# Altium schematic sheet Power.SchDoc
size A4
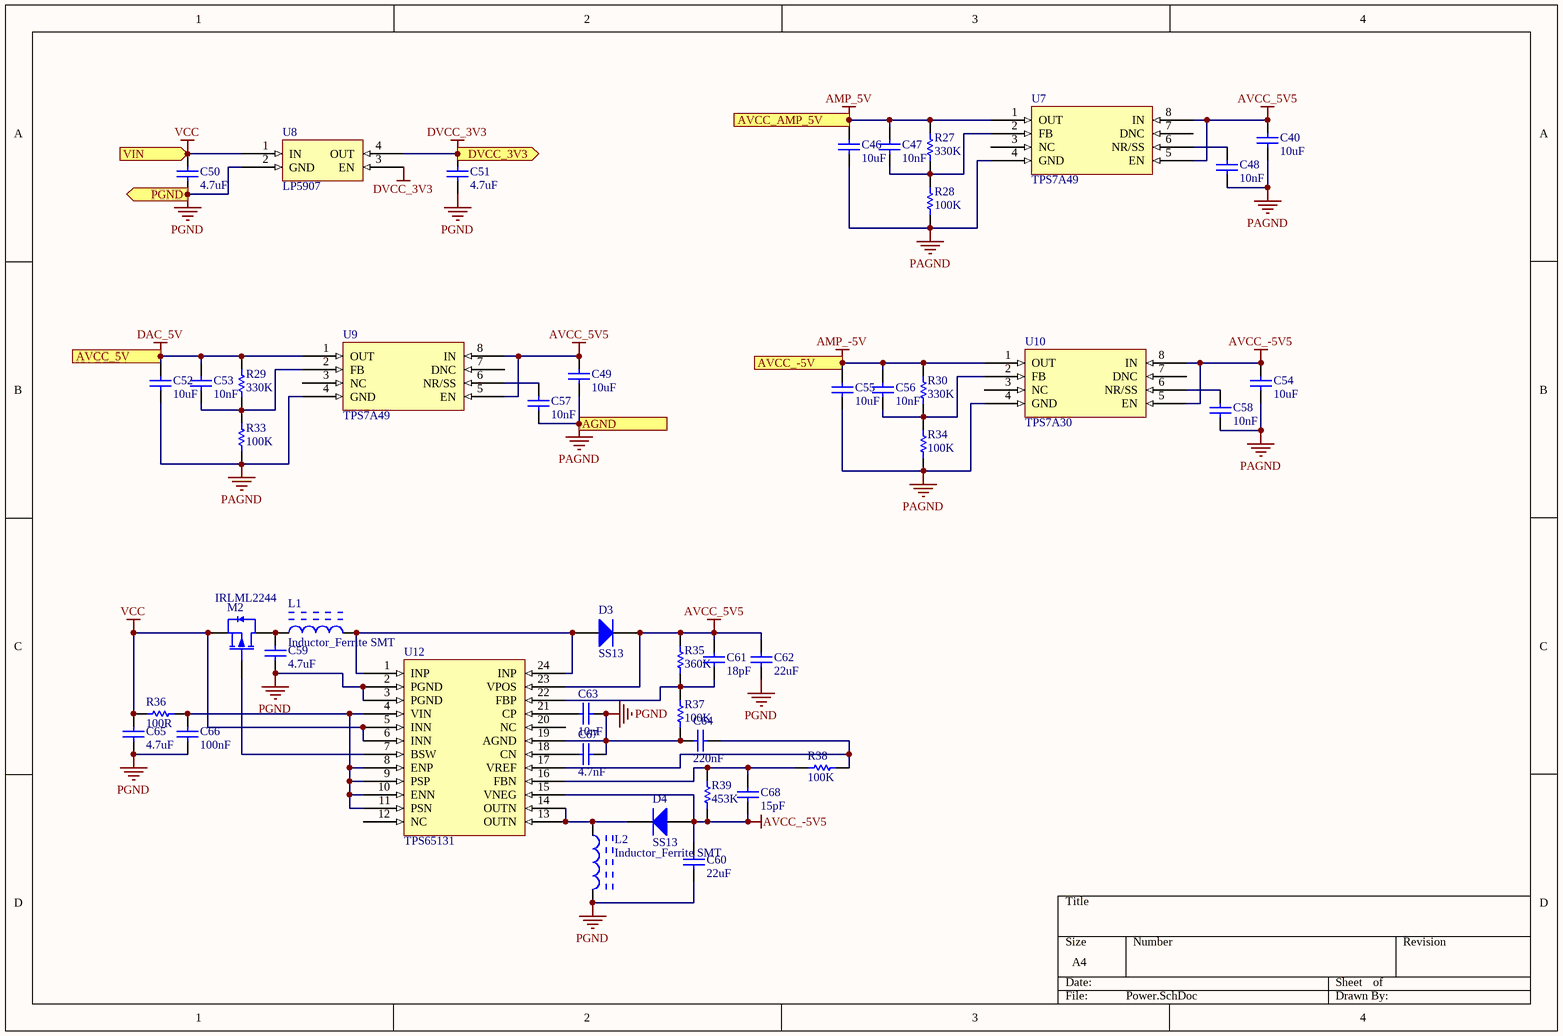
[diagram p0: Power.SchDoc]

## Parts
C40  10uF  [SMC_0805]
C46  10uF  [SMC_0805]
C47  10nF  [SMC_0805]
C48  10nF  [SMC_0805]
C49  10uF  [SMC_0805]
C50  4.7uF  [SMC_0805]
C51  4.7uF  [SMC_0805]
C52  10uF  [SMC_0805]
C53  10nF  [SMC_0805]
C54  10uF  [SMC_0805]
C55  10uF  [SMC_0805]
C56  10nF  [SMC_0805]
C57  10nF  [SMC_0805]
C58  10nF  [SMC_0805]
C59  4.7uF  [SMC_0805]
C60  22uF  [SMC_0805]
C61  18pF  [SMC_0805]
C62  22uF  [SMC_0805]
C63  10nF  [SMC_0805]
C64  220nF  [SMC_0805]
C65  4.7uF  [SMC_0805]
C66  100nF  [SMC_0805]
C67  4.7nF  [SMC_0805]
C68  15pF  [SMC_0805]
D3  SS13  [DO214-AC]
D4  SS13  [DO214-AC]
L1  Inductor_Ferrite SMT  [SML_4x4]
L2  Inductor_Ferrite SMT  [SML_4x4]
M2  IRLML2244  [SOT95P237X112-3N]
R27  330K  [SMR_0402]
R28  100K  [SMR_0402]
R29  330K  [SMR_0402]
R30  330K  [SMR_0402]
R33  100K  [SMR_0402]
R34  100K  [SMR_0402]
R35  360K  [SMR_0402]
R36  100R  [SMR_0805]
R37  100K  [SMR_0402]
R38  100K  [SMR_0402]
R39  453K  [SMR_0402]
U7  TPS7A49  [TSOP65P490X110_HS-9N]
U8  LP5907  [SOT95P280X110-5N - duplicate1]
U9  TPS7A49  [TSOP65P490X110_HS-9N]
U10  TPS7A30  [TSOP65P490X110_HS-9N]
U12  TPS65131  [QFN50P400X400X100_HS-25N]

## Ports
AGND (out), AVCC_5V (out), AVCC_-5V (out), AVCC_AMP_5V (out), DVCC_3V3 (out), PGND (out), VIN (in)

## Nets
AMP_5V: C46.1 C47.2 R27.2 U7.1(OUT) ; port AVCC_AMP_5V
AMP_-5V: C55.1 C56.2 R30.2 U10.1(OUT) ; port AVCC_-5V
AVCC_5V5: C40.1 C49.1 C61.2 C62.2 D3.K R35.2 U7.5(EN) U7.8(IN) U9.5(EN) U9.8(IN) U12.23(VPOS)
AVCC_-5V5: C54.1 C60.2 C68.1 D4.A R39.1 U10.5(EN) U10.8(IN) U12.15(VNEG)
DAC_5V: C52.1 C53.2 R29.2 U9.1(OUT) ; port AVCC_5V
DVCC_3V3: C51.2 U8.3(EN) U8.4(OUT) ; port DVCC_3V3
PAGND: C40.2 C46.2 C48.1 C49.2 C52.2 C54.2 C55.2 C57.1 C58.1 R28.1 R33.1 R34.1 U7.4(GND) U9.4(GND) U10.4(GND) ; port AGND
PGND: C50.1 C51.1 C59.1 C60.1 C62.1 C63.2 C64.1 C65.1 C66.1 C67.2 L2.2 R37.1 U8.2(GND) U12.2(PGND) U12.3(PGND) U12.19(AGND) ; port PGND
VCC: C50.2 C65.2 M2.S R36.1 U8.1(IN) U12.5(INN) U12.6(INN) ; port VIN
NetC47_1: C47.1 R27.1 R28.2 U7.2(FB)
NetC48_2: C48.2 U7.6(NR/SS)
NetC53_1: C53.1 R29.1 R33.2 U9.2(FB)
NetC56_1: C56.1 R30.1 R34.2 U10.2(FB)
NetC57_2: C57.2 U9.6(NR/SS)
NetC58_2: C58.2 U10.6(NR/SS)
NetC59_2: C59.2 L1.1 M2.D
NetC61_1: C61.1 R35.1 R37.2 U12.22(FBP)
NetC63_1: C63.1 U12.21(CP)
NetC64_2: C64.2 R38.2 U12.17(VREF)
NetC66_2: C66.2 R36.2 U12.4(VIN) U12.8(ENP) U12.9(PSP) U12.10(ENN) U12.11(PSN)
NetC67_1: C67.1 U12.18(CN)
NetC68_2: C68.2 R38.1 R39.2 U12.16(FBN)
NetD3_A: D3.A L1.2 U12.1(INP) U12.24(INP)
NetD4_K: D4.K L2.1 U12.13(OUTN) U12.14(OUTN)
NetM2_G: M2.G U12.7(BSW)

Not connected (* = marked no-connect by the designer): U7 3(NC) 7(DNC); U9 3(NC) 7(DNC); U10 3(NC) 7(DNC); U12 12(NC) 20(NC)

## Library data of the parts
C40 C46-C68 = Cap Ceramic
D3 D4 = Diode
R27-R30 R33-R39 = Res SMT